# EasyEDA Pro project drive.epro, schematic Schematic2
Board Name: Board2; Create Date: 2024-12-03; Page Name: P1; Project Name: 2025完全模型组硬件_Bone; Schematic Name: Schematic2; Update Date: 2024-12-13; Company: 嘉立创EDA; Page Size: A2; Version: V1.0
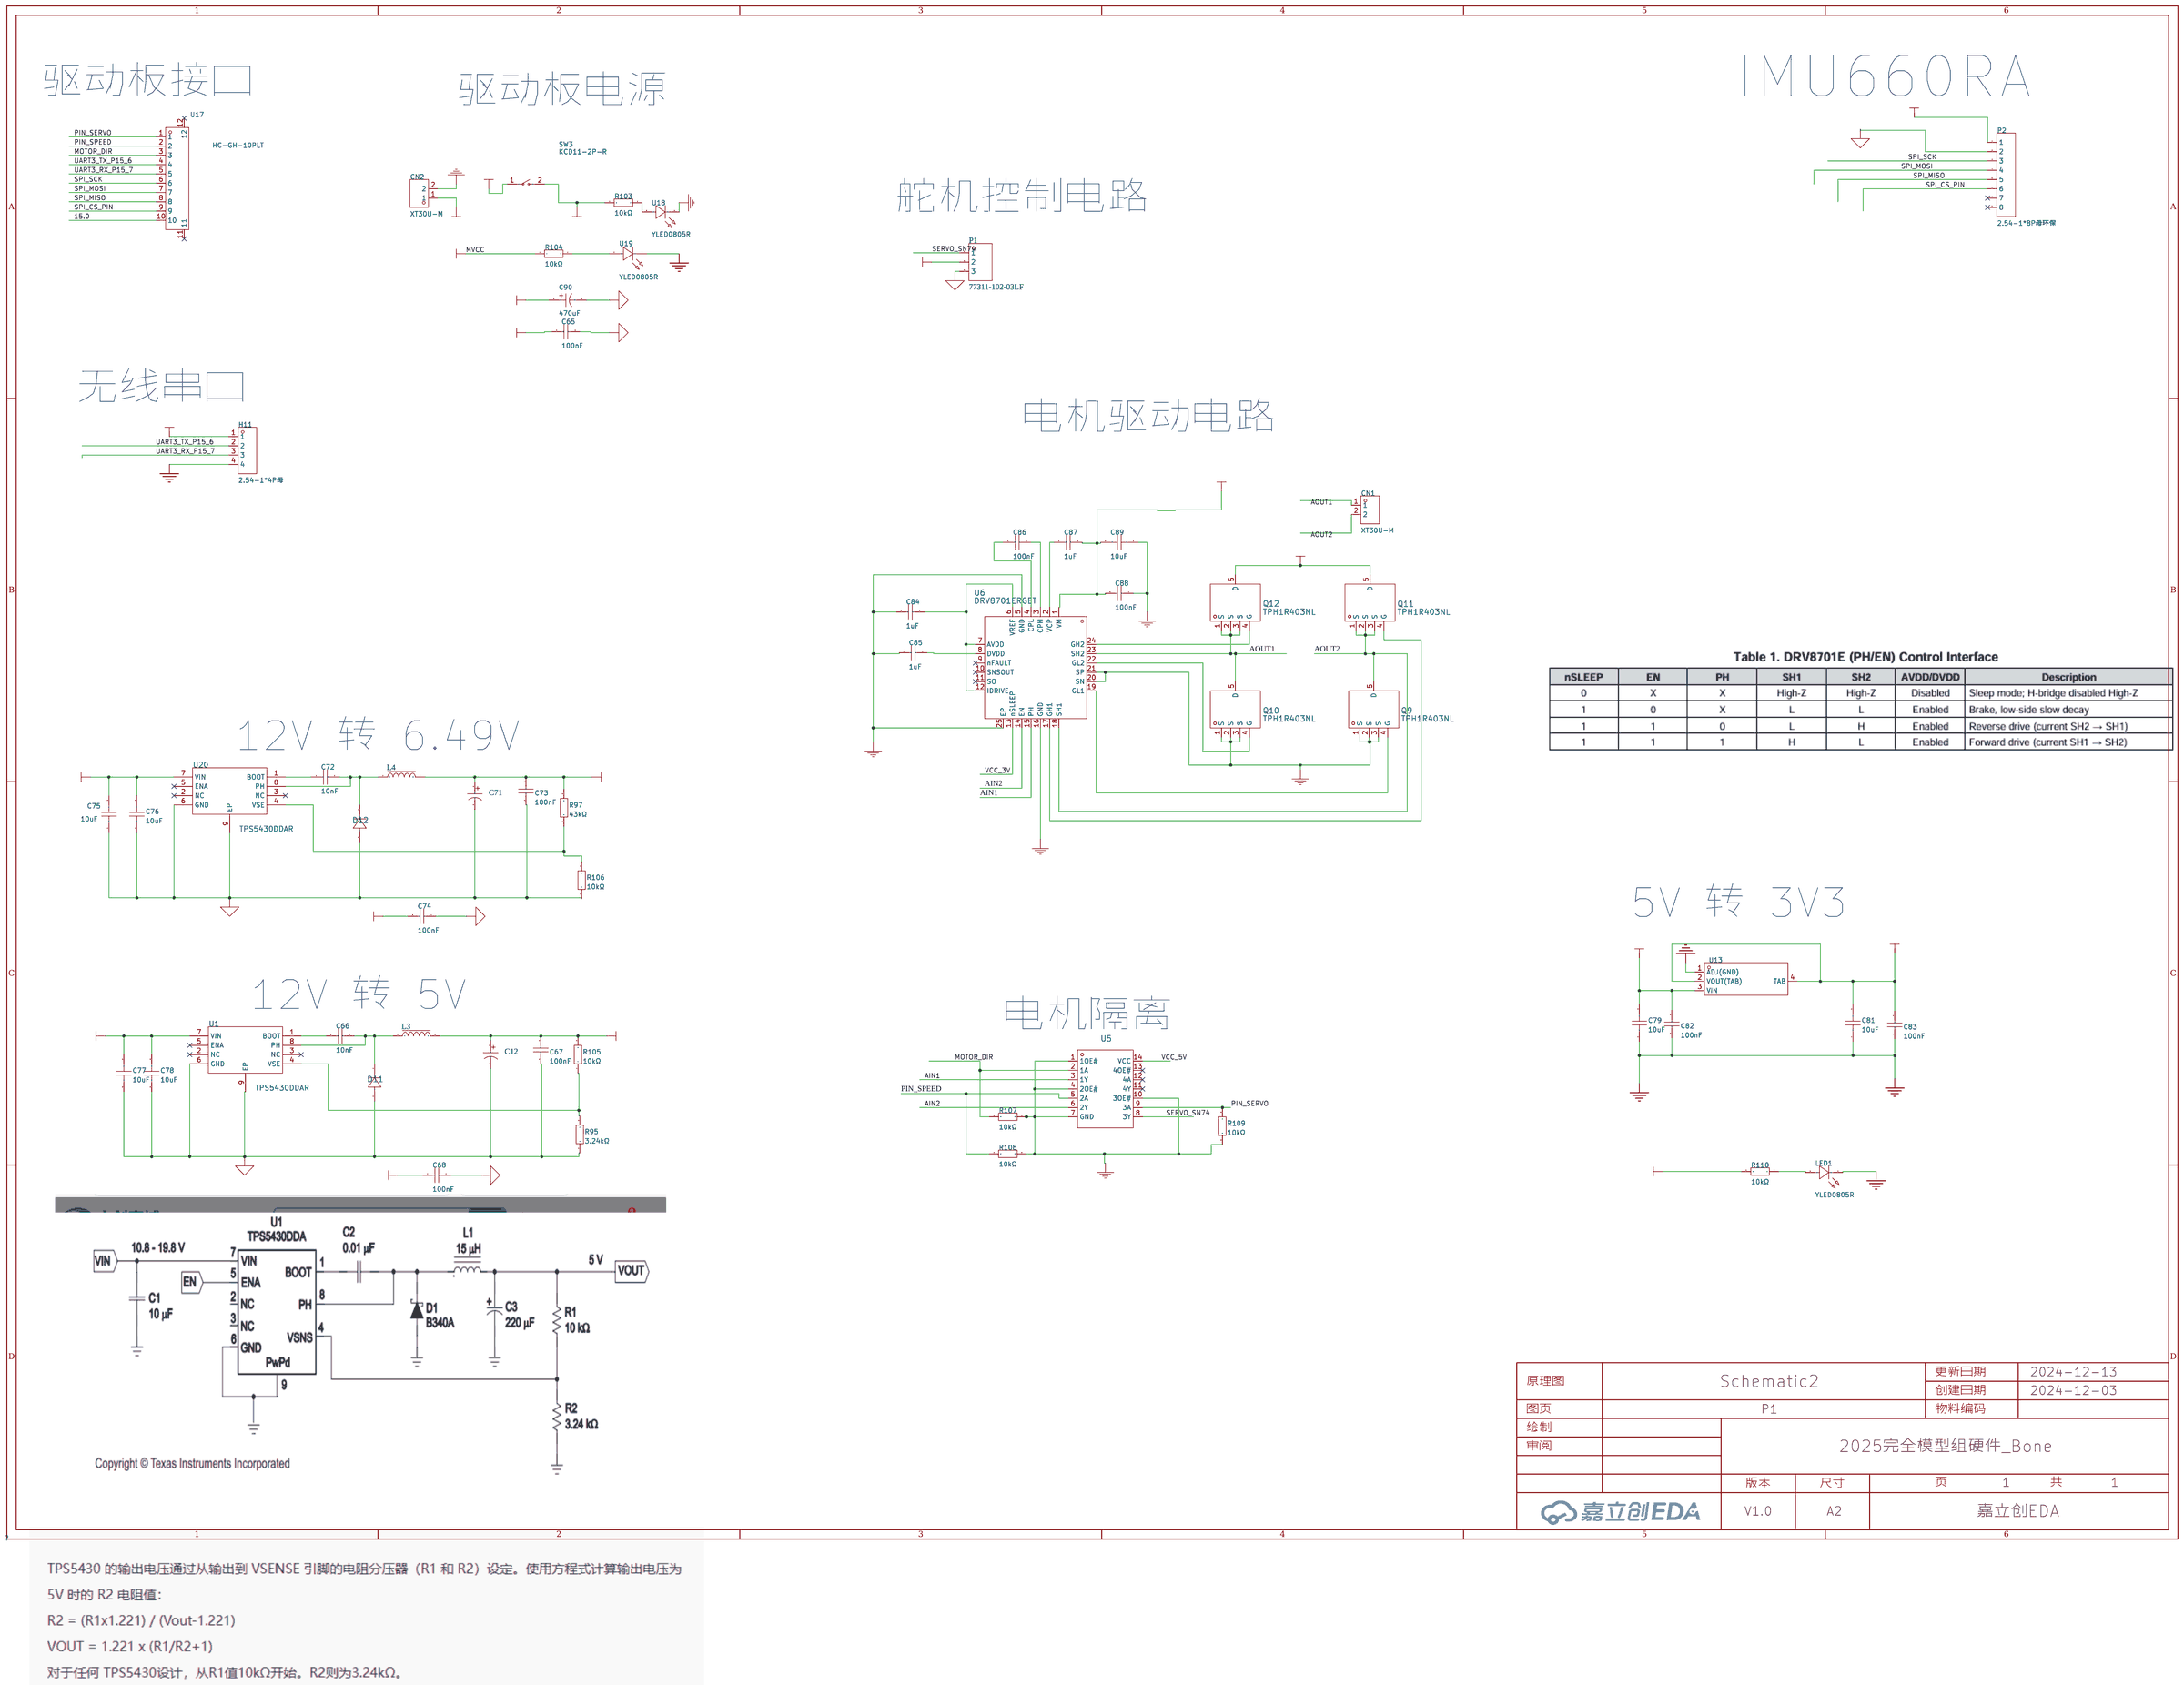
[diagram p1: schematic sheet]

## Parts
C12  220uF  [CAP-TH_BD8.0-P3.50-D0.6-FD]
C65  100nF  [C0805]
C66  10nF  [C0805]
C67  100nF  [C0805]
C68  100nF  [C0805]
C71  220uF  [CAP-TH_BD8.0-P3.50-D0.6-FD]
C72  10nF  [C0805]
C73  100nF  [C0805]
C74  100nF  [C0805]
C75  10uF  [C0805]
C76  10uF  [C0805]
C77  10uF  [C0805]
C78  10uF  [C0805]
C79  10uF  [C0805]
C81  10uF  [C0805]
C82  100nF  [C0805]
C83  100nF  [C0805]
C84  1uF  [C0805]
C85  1uF  [C0805]
C86  100nF  [C0805]
C87  1uF  [C0805]
C88  100nF  [C0805]
C89  10uF  [C0805]
C90  470uF  [CAP-TH_BD8.0-P3.50-D0.6-FD]
CN1  XT30U-M  [CONN-TH_XT30U-M]
CN2  XT30U-M  [CONN-TH_XT30U-M]
D11  SS34  [SMA_L4.3-W2.6-LS5.2-RD]
D12  SS34  [SMA_L4.3-W2.6-LS5.2-RD]
H11  2.54-1*4P母  [HDR-TH_4P-P2.54-V-F]
L3  15uH  [IND-SMD_L7.2-W6.6_GPSR07X0]
L4  15uH  [IND-SMD_L7.2-W6.6_GPSR07X0]
LED1  YLED0805R  [LED0805-RD]
P1  77311-102-03LF  [HDR-TH_3P-P2.54-V-M-1]
P2  2.54-1*8P母环保  [HDR-TH_8P-P2.54-V-F-1]
Q9  TPH1R403NL  [POWERVDFN-8_L6.2-W5.2-P1.27-LS6.0-BL]
Q10  TPH1R403NL  [POWERVDFN-8_L6.2-W5.2-P1.27-LS6.0-BL]
Q11  TPH1R403NL  [POWERVDFN-8_L6.2-W5.2-P1.27-LS6.0-BL]
Q12  TPH1R403NL  [POWERVDFN-8_L6.2-W5.2-P1.27-LS6.0-BL]
R95  3.24kΩ  [R0805]
R97  43kΩ  [R0805]
R103  10kΩ  [R0805]
R104  10kΩ  [R0805]
R105  10kΩ  [R0805]
R106  10kΩ  [R0805]
R107  10kΩ  [R0805]
R108  10kΩ  [R0805]
R109  10kΩ  [R0805]
R110  10kΩ  [R0805]
SW3  KCD11-2P-R  [SW-TH_2P-L15.0-W10.5-P5.00_KCD11-2P-R]
U1  TPS5430DDAR  [SOIC-8_L5.0-W4.0-P1.27-LS6.0-BL-EP2.0]
U5  SN74HC125DR  [SOIC-14_L8.7-W3.9-P1.27-LS6.0-BL]
U6  DRV8701ERGET  [VQFN-24_L4.0-W4.0-P0.50-BL-EP2.5]
U13  AMS1117-3.3  [SOT-223-4_L6.5-W3.5-P2.30-LS7.0-BR]
U17  HC-GH-10PLT  [CONN-SMD_10P-P1.25_HCTL_HC-GH-10PLT]
U18  YLED0805R  [LED0805-RD]
U19  YLED0805R  [LED0805-RD]
U20  TPS5430DDAR  [SOIC-8_L5.0-W4.0-P1.27-LS6.0-BL-EP2.0]

## Library data of the parts
C12 C71 = KM227M035F12RR0VH2FP0: 容值:220uF;精度:±20%;额定电压:35V;纹波电流:-;等效串联电阻:-;; LCSC Part Name: 220uF ±20% 35V; Supplier Part: C2063; Manufacturer: CX(承兴); Supplier Footprint: 插件,D8xL12mm; JLCPCB Part Class: Extended Part; Datasheet: https://atta.szlcsc.com/upload/public/pdf/source/20211027/06D6BA3719C264B639DC286D935D03EA.pdf; Supplier: LCSC; Tolerance: ±20%; Rated Voltage: 35V; φD: 8mm; L: 12mm; Lead Spacing: 3.5mm; Lifetime @ Temp: 2000hrs@105℃; Voltage Rated: 50V; Temperature Coefficient: X7R; Design Item ID: C_0603; Library Name: Schlib_AISmartCar
C65 C67 C68 C73 C74 C82 C83 C86 C88 = CL21B104KBCNNNC: 容值:100nF;精度:±10%;额定电压:50V;材质(温度系数):X7R;; LCSC Part Name: 100nF ±10% 50V; Supplier Part: C1711; Manufacturer: SAMSUNG(三星); Supplier Footprint: 0805; Datasheet: https://atta.szlcsc.com/upload/public/pdf/source/20160218/1457707763339.pdf; Supplier: LCSC; Tolerance: ±10%; Voltage Rated: 50V; Temperature Coefficient: X7R
C66 C72 = CL21B103KBANNNC: 容值:10nF;精度:±10%;额定电压:50V;材质(温度系数):X7R;; LCSC Part Name: 10nF ±10% 50V; Supplier Part: C1710; Manufacturer: SAMSUNG(三星); Supplier Footprint: 0805; Datasheet: https://atta.szlcsc.com/upload/public/pdf/source/20160218/1457707763339.pdf; Supplier: LCSC; Tolerance: ±10%; Voltage Rated: 50V; Temperature Coefficient: X7R
C75-C79 C81 C89 = GRM21BR61H106KE43L: 容值:10uF;精度:±10%;额定电压:50V;材质(温度系数):X5R;; LCSC Part Name: 10uF ±10% 50V; Supplier Part: C440198; Manufacturer: muRata(村田); Supplier Footprint: 0805; Datasheet: https://atta.szlcsc.com/upload/public/pdf/source/20230811/95AAE0C9AF55EDC31B7A4D8B733F534E.pdf; Supplier: LCSC; Tolerance: ±10%; Voltage Rated: 50V; Temperature Coefficient: X5R
C84 C85 C87 = CL21B105KBFNNNE: 容值:1uF;精度:±10%;额定电压:50V;材质(温度系数):X7R;; LCSC Part Name: 1uF ±10% 50V; Supplier Part: C28323; Manufacturer: SAMSUNG(三星); Supplier Footprint: 0805; JLCPCB Part Class: 基础库; Datasheet: https://atta.szlcsc.com/upload/public/pdf/source/20160218/1457707763339.pdf; Supplier: LCSC; Tolerance: ±10%; Voltage Rated: 50V; Temperature Coefficient: X7R
C90 = ERS1CM471F12OT: 容值:470uF;精度:±20%;额定电压:16V;; LCSC Part Name: 470uF ±20% 16V; Supplier Part: C160146; Manufacturer: AISHI(艾华集团); Supplier Footprint: 插件,D8xL12mm; JLCPCB Part Class: Extended Part; Datasheet: https://atta.szlcsc.com/upload/public/pdf/source/20191015/C438940_4B8E60A742BB0AE40DDEF87A5C89089D.pdf; Supplier: LCSC; Tolerance: ±20%; Rated Voltage: 16V; Lead Spacing: 3.5mm; φD: 8mm; L: 12mm; Lifetime @ Temp: 7000hrs@105℃
CN1 CN2 = XT30U-M: 模型插头轻量版锂电池插头; LCSC Part Name: AMASS(艾迈斯)轻量版锂电池插头公头 XT30U-M; Supplier Part: C99101; Manufacturer: AMASS(艾迈斯); JLCPCB Part Class: Extended Part; Datasheet: https://atta.szlcsc.com/upload/public/pdf/source/20170606/1496716542582.pdf; Supplier: LCSC
D11 D12 = SS34_C8678: 二极管配置:独立式;直流反向耐压(Vr):40V;平均整流电流(Io):3A;正向压降(Vf):550mV@3A;; LCSC Part Name: 40V 3A 550mV@3A; Supplier Part: C8678; Manufacturer: MDD; Supplier Footprint: SMA(DO-214AC); JLCPCB Part Class: Basic Part; Datasheet: https://atta.szlcsc.com/upload/public/pdf/source/20230314/A80AE34493C69B89E2F4B1712F433538.pdf; Supplier: LCSC; Diode Configuration: 独立式; Reverse Voltage (Vr): 40V; Average Rectified Current (Io): 3A; Forward Voltage (Vf@If): 550mV@3A; Reverse Leakage Current (Ir): 500uA@40V; Power Dissipation: 400mW; Reverse Leakage Current: 1uA@75V; Reverse Recovery Time (trr): 8ns; Operating Temperature: -55℃~+150℃@(Tj); Check: true
H11 = 2.54-1*4P母: 插孔结构:1x4P;间距:2.54mm;行距:-;圆孔/方孔:方孔;安装类型:直插;排数:单排;总孔位数:4P;额定电流:3A;额定电压:-;插孔方向:顶部;塑高:-;触头材质:青铜;触头镀层:-;工作温度范围:-40℃~+105℃;焊接温度(最大值):-;; LCSC Part Name: 间距:2.54mm 1x4P 直插; Supplier Part: C2718488; Manufacturer: BOOMELE(博穆精密); Supplier Footprint: 插件,P=2.54mm; JLCPCB Part Class: 扩展库; Datasheet: https://atta.szlcsc.com/upload/public/pdf/source/20210301/C2718488_F4427B881E42CAA8DDB0B1C12B3A522C.pdf; Supplier: LCSC; Holes Structure: 1x4P; Pitch: 2.54mm; Circular Hole / Square Hole: 方孔; Mounting Type: 直插; Number of Rows: 单排; Number of Holes: 4P; Current Rating (Max): 3A; Holes Direction: 顶部; Contact Material: 青铜; Operating Temperature Range: -40℃~+105℃
L3 L4 = CYA0630-15UH: 电感值:15uH;精度:±20%;额定电流:3A;直流电阻(DCR):98mΩ;; LCSC Part Name: 15uH ±20% 98mΩ; Supplier Part: C5189959; Manufacturer: SHOU HAN(首韩); Supplier Footprint: SMD,6.6x7.2mm; JLCPCB Part Class: Extended Part; Datasheet: https://atta.szlcsc.com/upload/public/pdf/source/20221010/DA5ED07F016B1136355C6E3EFCD4CFD8.pdf; Supplier: LCSC; Tolerance: ±20%; Rated Current: 3A; DC Resistance (DCR): 98mΩ; Width: 6mm; Height: 3mm; Length: 6.4mm; Design Item ID: L_7*7*4; Library Name: Schlib_AISmartCar
LED1 U18 U19 = YLED0805R: 发光颜色:红色;正向电压(VF):1.8V~2.4V;功率:60mW;正向电流:20mA;主波长:615nm~630nm;二极管配置:-;透镜颜色:-;色温:-;发光强度:-;发光角度:-;载带方式:-;工作温度:-40℃~+85℃;; Supplier Part: C19171391; Manufacturer: YONGYUTAI(永裕泰); Supplier Footprint: 0805; Datasheet: https://atta.szlcsc.com/upload/public/pdf/source/20231027/AB486D22E6D71BC59190C48A798367E6.pdf; Supplier: LCSC; Emitted Color: 红色; Forward Voltage (VF): 1.8V~2.4V; Power Dissipation: 60mW; Forward Current: 20mA; Dominant Wavelength: 615nm~630nm; Peak Wavelength: 645nm; Operating Temperature: -40℃~+85℃
P1 = 77311-102-03LF: 间距:2.54mm;总PIN位数:3;排数:1;插针结构:-;行距:-;安装类型:直插;圆针/方针:-;额定电流:-;额定电压:-;配合针长度:-;塑高:-;触头材质:磷青铜;触头镀层:-;颜色:黑色;; LCSC Part Name: 1x3P 2.54mm 一针算一个料; Supplier Part: C180248; Manufacturer: Amphenol; Supplier Footprint: 插件,P=2.54mm; JLCPCB Part Class: Extended Part; Datasheet: https://atta.szlcsc.com/upload/public/pdf/source/20180329/C180248_62E264527695F7ED58561BB828D45E42.pdf; Supplier: LCSC; Pitch: 2.54mm; Number of Pins: 3; Number of Rows: 1; Mounting Type: 直插; Contact Material: 磷青铜; Color: 黑色; Design Item ID: KF2510-3A; Library Name: Schlib_AISmartCar; LatestRevisionDate: 17-Jul-2002; LatestRevisionNote: Re-released for DXP Platform.; Publisher: Altium Limited; Check: false
P2 = 2.54-1*8P母环保: 插孔结构:1x8P;间距:2.54mm;行距:-;安装类型:直插;排数:单排;总孔位数:8P;塑高:-;触头材质:-;触头镀层:-;; LCSC Part Name: 间距:2.54mm 1x8P 直插; Supplier Part: C27438; Manufacturer: BOOMELE(博穆精密); Supplier Footprint: 插件,P=2.54mm; JLCPCB Part Class: 扩展库; Datasheet: https://atta.szlcsc.com/upload/public/pdf/source/20231221/1CA800C6799ED97958773716FAA1BFFE.pdf; Supplier: LCSC; Holes Structure: 1x8P; Pitch: 2.54mm; Mounting Type: 直插; Number of Rows: 单排; Number of Holes: 8P
Q9-Q12 = TPH1R403NL: Supplier: LCSC; Manufacturer: TOSHIBA; Supplier Part: C83440; Paste Type: expand
R95 = 0805W8F3241T5E: 电阻类型:厚膜电阻;阻值:3.24kΩ;精度:±1%;功率:125mW;最大工作电压:150V;温度系数:±100ppm/℃;; LCSC Part Name: 3.24kΩ ±1% 125mW 厚膜电阻; Supplier Part: C17609; Manufacturer: UNI-ROYAL(厚声); Supplier Footprint: 0805; Datasheet: https://atta.szlcsc.com/upload/public/pdf/source/20200306/C422600_1E6D84923E4A46A82E41ADD87F860B5C.pdf; Supplier: LCSC; Type: 厚膜电阻; Tolerance: ±1%; Power(Watts): 125mW; Overload Voltage (Max): 150V; Temperature Coefficient: ±100ppm/℃; Operating Temperature Range: -55℃~+155℃
R97 = 0805W8F4302T5E: 电阻类型:厚膜电阻;阻值:43kΩ;精度:±1%;功率:125mW;最大工作电压:150V;温度系数:±100ppm/℃;; LCSC Part Name: 43kΩ ±1% 125mW 厚膜电阻; Supplier Part: C17695; Manufacturer: UNI-ROYAL(厚声); Supplier Footprint: 0805; Datasheet: https://atta.szlcsc.com/upload/public/pdf/source/20200306/C422600_1E6D84923E4A46A82E41ADD87F860B5C.pdf; Supplier: LCSC; Type: 厚膜电阻; Tolerance: ±1%; Power(Watts): 125mW; Overload Voltage (Max): 150V; Temperature Coefficient: ±100ppm/℃; Operating Temperature Range: -55℃~+155℃
R103-R110 = 0805W8J0103T5E: 电阻类型:厚膜电阻;阻值:10kΩ;精度:±5%;功率:125mW;最大工作电压:150V;温度系数:±100ppm/℃;; LCSC Part Name: 10kΩ ±5% 125mW 厚膜电阻; Supplier Part: C25612; Manufacturer: UNI-ROYAL(厚声); Supplier Footprint: 0805; Datasheet: https://atta.szlcsc.com/upload/public/pdf/source/20200306/C422600_1E6D84923E4A46A82E41ADD87F860B5C.pdf; Supplier: LCSC; Type: 厚膜电阻; Tolerance: ±5%; Power(Watts): 125mW; Overload Voltage (Max): 150V; Temperature Coefficient: ±100ppm/℃; Operating Temperature Range: -55℃~+155℃
SW3 = KCD11-2P-R: 带灯:无;引脚样式:焊片;额定电流:3A;额定电压(AC):250V;额定电压(DC):-;电路结构:单刀单掷;机械寿命:1万次;; LCSC Part Name: 10.5*15mm 两脚两档跷板开关 红钮; Supplier Part: C5884414; Manufacturer: SHOU HAN(首韩); Supplier Footprint: 插件; JLCPCB Part Class: Extended Part; Datasheet: https://atta.szlcsc.com/upload/public/pdf/source/20230506/CD06DFDE35C8048D34175BFF4AF6A2C2.pdf; Supplier: LCSC; Switch Length: 15mm; Switch Width: 10.5mm; Switch Height: 17.2mm; Actuator Type: 凹面弯曲; With Lamp: 无; Pin Style: 焊片; Actuator Color: 红色; Contact Current: 3A; Voltage Rating (AC): 250V; Circuit: 单刀单掷; Mechanical Life: 1万次; Operating Temperature: 0℃~+125℃; Actuator Identifier: - O
U1 U20 = TPS5430DDAR: 可输出电流:3A;开关工作频率:500kHz;输出类型:Adjustable;输出电压的路数:1;功能类型:Step-Down;输出配置:Positive;; Supplier Part: C9864; Manufacturer: TI(德州仪器); Supplier Footprint: SOP-8_EP_150mil; JLCPCB Part Class: Basic Part; Datasheet: https://atta.szlcsc.com/upload/public/pdf/source/20161207/1481104217724.pdf; Supplier: LCSC; Library Name: Schlib_AISmartCar
U5 = SN74HC125DR: 输入类型:-;电源电压:2V~6V;元件数:4;每个元件位数:1;灌电流(IOL):7.8mA;拉电流(IOH):7.8mA;; Supplier Part: C42322; Manufacturer: TI(德州仪器); Supplier Footprint: SOIC-14; JLCPCB Part Class: Extended Part; Datasheet: https://www.ti.com/cn/lit/gpn/sn74hc125; Supplier: LCSC; output type: 三态; Supply Voltage: 2V~6V; Number of Elements: 4; Number of Bits per Element: 1; Sink Current: 7.8mA; Source Current: 7.8mA; Logic Family: 74HC; Operating Temperature: -40℃~+85℃; Paste Type: expand
U6 = DRV8701ERGET: DRV8701 47V H 桥智能栅极驱动器; LCSC Part Name: 有刷直流电机驱动芯片 5.5V; Supplier Part: C132049; Manufacturer: TI(德州仪器); Supplier Footprint: VQFN-24(4x4); JLCPCB Part Class: Extended Part; Datasheet: https://www.ti.com/cn/lit/gpn/drv8701; Supplier: LCSC
U13 = AMS1117-3.3_C347222: 输出类型:固定;最大输入电压:18V;输出电压:3.3V;输出电流:1A;电源纹波抑制比(PSRR):60dB@(120Hz);输出极性:正;; LCSC Part Name: 输入18V 输出3.3V 1A; Supplier Part: C347222; Manufacturer: UMW(友台半导体); Supplier Footprint: SOT-223; JLCPCB Part Class: Extended Part; Datasheet: https://atta.szlcsc.com/upload/public/pdf/source/20231109/155D79A26D9DB04352555A58D5969DC8.pdf; Supplier: LCSC; Output Type: 固定; Maximum Input Voltage: 18V; Output Voltage: 3.3V; Output Current: 1A; Power Supply Rejection Ratio (PSRR): 60dB@(120Hz); Dropout Voltage: 1.3V@(1A); Output Polarity: 正; Number of Outputs: 1; Quiescent Current (Ground Current): 12mA; Operating Temperature: 0℃~+125℃
U17 = HC-GH-10PLT_C3011961: 插针结构:1x10P;间距:1.25mm;安装方式:立贴;参考系列:GH;总PIN数:10P;排数:1;每排PIN数:10;行距:-;额定电流:1A;触头材质:磷铜;触头镀层:锡;工作温度范围:-25℃~+85℃;; LCSC Part Name: 1x10P 间距:1.25mm 立贴 系列:GH; Supplier Part: C3011961; Manufacturer: HCTL(华灿天禄); Supplier Footprint: SMD,P=1.25mm; Datasheet: https://atta.szlcsc.com/upload/public/pdf/source/20210728/C2845406_3EB3A7BF0D8EC31310CEF8E2A2CF0B88.pdf; Supplier: LCSC; Pins Structure: 1x10P; Pitch: 1.25mm; Mounting Style: 立贴; Reference Series: GH; Number of Pins: 10P; Number of Rows: 1; Number of PINs Per Row: 10; Current Rating (Max): 1A; Contact Material: 磷铜; Contact Plating: 锡; Operating Temperature Range: -25℃~+85℃; Rated Voltage (Max): 50V; Plastic Material: LCP; Supplementary Features: 辅助焊脚

## Nets
PGND: C12.2 C65.2 C67.1 C68.1 C71.2 C73.1 C74.1 C75.1 C76.1 C77.1 C78.1 C79.1 C81.1 C82.1 C83.1 C84.1 C85.1 C88.1 C89.1 C90.2 CN2.2 D11.2(A) D12.2(A) H11.4 LED1.1(K) P1.3 P2.2 Q9.1(S) Q9.2(S) Q9.3(S) Q10.1(S) Q10.2(S) Q10.3(S) R95.1 R106.1 R107.2 R108.2 R109.2 U1.6(GND) U1.9(EP) U5.1(1OE#) U5.4(2OE#) U5.7(GND) U5.10(3OE#) U6.5(GND) U6.16(GND) U6.20(SN) U6.21(SP) U6.25(EP) U13.1(ADJ(GND)) U18.1(K) U19.1(K) U20.6(GND) U20.9(EP)
VCC_3V: C81.2 C83.2 P2.1 R110.1 U6.13(nSLEEP) U13.2(VOUT(TAB)) U13.4(TAB)
VCC_5V: C12.1 C67.2 C68.2 C79.2 C82.2 H11.1 L3.2 R105.2 U5.14(VCC) U13.3(VIN)
VCC_6_79V: C71.1 C73.2 C74.2 L4.2 P1.2 R97.2
VCC_12V: C75.2 C76.2 C77.2 C78.2 C87.2 C88.2 C89.2 Q11.5(D) Q12.5(D) R103.1 SW3.2 U1.7(VIN) U6.1(VM) U20.7(VIN)
15.0: U17.10
AIN1: U5.3(1Y) U6.15(PH)
AIN2: U5.6(2Y) U6.14(EN)
AOUT1: CN1.1 Q10.5(D) Q12.1(S) Q12.2(S) Q12.3(S) U6.23(SH2)
AOUT2: CN1.2 Q9.5(D) Q11.1(S) Q11.2(S) Q11.3(S) U6.18(SH1)
MOTOR_DIR: R107.1 U5.2(1A) U17.3
MVCC: C65.1 C90.1 CN2.1 R104.1 SW3.1
PIN_SERVO: R109.1 U5.9(3A) U17.1
PIN_SPEED: R108.1 U5.5(2A) U17.2
SERVO_SN74: P1.1 U5.8(3Y)
SPI_CS_PIN: P2.6 U17.9
SPI_MISO: P2.5 U17.8
SPI_MOSI: P2.4 U17.7
SPI_SCK: P2.3 U17.6
UART3_RX_P15_7: H11.3 U17.5
UART3_TX_P15_6: H11.2 U17.4
$1N771: R104.2 U19.2(A)
$1N779: R103.2 U18.2(A)
$1N1828: C66.2 D11.1(C) L3.1 U1.8(PH)
$1N1829: R95.2 R105.1 U1.4(VSE)
$1N1832: C66.1 U1.1(BOOT)
$1N3138: C72.2 D12.1(C) L4.1 U20.8(PH)
$1N3145: R97.1 R106.2 U20.4(VSE)
$1N3169: C72.1 U20.1(BOOT)
$1N4767: Q12.4(G) U6.24(GH2)
$1N4768: Q10.4(G) U6.22(GL2)
$1N4769: Q9.4(G) U6.19(GL1)
$1N4771: Q11.4(G) U6.17(GH1)
$1N4774: C84.2 U6.6(VREF) U6.7(AVDD) U6.12(IDRIVE)
$1N4775: C85.2 U6.8(DVDD)
$1N4776: C86.2 U6.4(CPL)
$1N4777: C86.1 U6.3(CPH)
$1N4778: C87.1 U6.2(VCP)
$1N6651: LED1.2(A) R110.2

Not connected (* = marked no-connect by the designer): P2 7* 8*; U1 2(NC)* 3(NC)* 5(ENA)*; U5 11(4Y)* 12(4A)* 13(4OE#)*; U6 9(nFAULT)* 10(SNSOUT)* 11(SO)*; U17 11* 12*; U20 2(NC)* 3(NC)* 5(ENA)*

## Notes on the sheet
- 驱动板接口
- IMU660RA
- 驱动板电源
- 舵机控制电路
- 无线串口
- 电机驱动电路
- 12V 转 6.49V
- 5V 转 3V3
- 12V 转 5V
- 电机隔离
